# Altium project Keyboard.PrjPcb
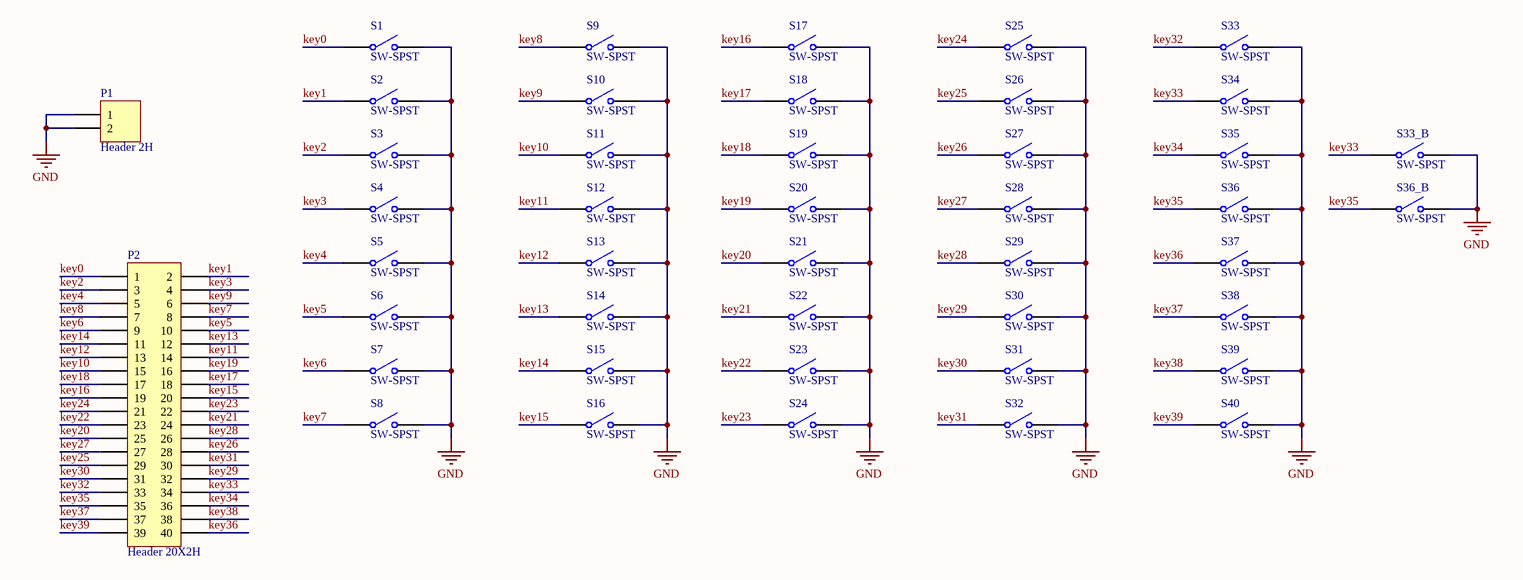
[diagram p0: keyboard.SchDoc]
1 sheet, 44 parts. Net scope: global (net labels, ports and power ports of the same name join across sheets).
Board file: Mickeyboard2.PcbDoc

## Sheet keyboard.SchDoc
size Legal

### Parts
P1  Header 2H  [HDR1X2H]
P2  Header 20X2H  [HDR2X20H]
S1  SW-SPST  [CherryMxSwitchNoLED]
S2  SW-SPST  [CherryMxSwitchNoLED]
S3  SW-SPST  [CherryMxSwitchNoLED]
S4  SW-SPST  [CherryMxSwitchNoLED]
S5  SW-SPST  [CherryMxSwitchNoLED]
S6  SW-SPST  [CherryMxSwitchNoLED]
S7  SW-SPST  [CherryMxSwitchNoLED]
S8  SW-SPST  [CherryMxSwitchNoLED]
S9  SW-SPST  [CherryMxSwitchNoLED]
S10  SW-SPST  [CherryMxSwitchNoLED]
S11  SW-SPST  [CherryMxSwitchNoLED]
S12  SW-SPST  [CherryMxSwitchNoLED]
S13  SW-SPST  [CherryMxSwitchNoLED]
S14  SW-SPST  [CherryMxSwitchNoLED]
S15  SW-SPST  [CherryMxSwitchNoLED]
S16  SW-SPST  [CherryMxSwitchNoLED]
S17  SW-SPST  [CherryMxSwitchNoLED]
S18  SW-SPST  [CherryMxSwitchNoLED]
S19  SW-SPST  [CherryMxSwitchNoLED]
S20  SW-SPST  [CherryMxSwitchNoLED]
S21  SW-SPST  [CherryMxSwitchNoLED]
S22  SW-SPST  [CherryMxSwitchNoLED]
S23  SW-SPST  [CherryMxSwitchNoLED]
S24  SW-SPST  [CherryMxSwitchNoLED]
S25  SW-SPST  [CherryMxSwitchNoLED]
S26  SW-SPST  [CherryMxSwitchNoLED]
S27  SW-SPST  [CherryMxSwitchNoLED]
S28  SW-SPST  [CherryMxSwitchNoLED]
S29  SW-SPST  [CherryMxSwitchNoLED]
S30  SW-SPST  [CherryMxSwitchNoLED]
S31  SW-SPST  [CherryMxSwitchNoLED]
S32  SW-SPST  [CherryMxSwitchNoLED]
S33  SW-SPST  [CherryMxSwitchNoLED]
S33_B  SW-SPST  [CherryMxSwitchNoLED]
S34  SW-SPST  [CherryMxSwitchNoLED]
S35  SW-SPST  [CherryMxSwitchNoLED]
S36  SW-SPST  [CherryMxSwitchNoLED]
S36_B  SW-SPST  [CherryMxSwitchNoLED]
S37  SW-SPST  [CherryMxSwitchNoLED]
S38  SW-SPST  [CherryMxSwitchNoLED]
S39  SW-SPST  [CherryMxSwitchNoLED]
S40  SW-SPST  [CherryMxSwitchNoLED]

### Nets
GND: P1.1 P1.2 S1.2(NO) S2.2(NO) S3.2(NO) S4.2(NO) S5.2(NO) S6.2(NO) S7.2(NO) S8.2(NO) S9.2(NO) S10.2(NO) S11.2(NO) S12.2(NO) S13.2(NO) S14.2(NO) S15.2(NO) S16.2(NO) S17.2(NO) S18.2(NO) S19.2(NO) S20.2(NO) S21.2(NO) S22.2(NO) S23.2(NO) S24.2(NO) S25.2(NO) S26.2(NO) S27.2(NO) S28.2(NO) S29.2(NO) S30.2(NO) S31.2(NO) S32.2(NO) S33.2(NO) S33_B.2(NO) S34.2(NO) S35.2(NO) S36.2(NO) S36_B.2(NO) S37.2(NO) S38.2(NO) S39.2(NO) S40.2(NO)
key0: P2.1 S1.1(COMMON)
key1: P2.2 S2.1(COMMON)
key2: P2.3 S3.1(COMMON)
key3: P2.4 S4.1(COMMON)
key4: P2.5 S5.1(COMMON)
key5: P2.10 S6.1(COMMON)
key6: P2.9 S7.1(COMMON)
key7: P2.8 S8.1(COMMON)
key8: P2.7 S9.1(COMMON)
key9: P2.6 S10.1(COMMON)
key10: P2.15 S11.1(COMMON)
key11: P2.14 S12.1(COMMON)
key12: P2.13 S13.1(COMMON)
key13: P2.12 S14.1(COMMON)
key14: P2.11 S15.1(COMMON)
key15: P2.20 S16.1(COMMON)
key16: P2.19 S17.1(COMMON)
key17: P2.18 S18.1(COMMON)
key18: P2.17 S19.1(COMMON)
key19: P2.16 S20.1(COMMON)
key20: P2.25 S21.1(COMMON)
key21: P2.24 S22.1(COMMON)
key22: P2.23 S23.1(COMMON)
key23: P2.22 S24.1(COMMON)
key24: P2.21 S25.1(COMMON)
key25: P2.29 S26.1(COMMON)
key26: P2.28 S27.1(COMMON)
key27: P2.27 S28.1(COMMON)
key28: P2.26 S29.1(COMMON)
key29: P2.32 S30.1(COMMON)
key30: P2.31 S31.1(COMMON)
key31: P2.30 S32.1(COMMON)
key32: P2.33 S33.1(COMMON)
key33: P2.34 S33_B.1(COMMON) S34.1(COMMON)
key34: P2.36 S35.1(COMMON)
key35: P2.35 S36.1(COMMON) S36_B.1(COMMON)
key36: P2.40 S37.1(COMMON)
key37: P2.37 S38.1(COMMON)
key38: P2.38 S39.1(COMMON)
key39: P2.39 S40.1(COMMON)

### Notes on the sheet
- Title
- Size:
- Date:
- Legal
- Number:
- Time:
- Revision:
- Sheet
- of
- File:

### Library data of the parts
P1 = Header 2H: Header, 2-Pin, Right Angle; LatestRevisionDate: 17-Jul-2002; LatestRevisionNote: Re-released for DXP Platform.; Publisher: Altium Limited
P2 = Header 20X2H: Header, 20-Pin, Dual row, Right Angle; LatestRevisionDate: 17-Jul-2002; LatestRevisionNote: Re-released for DXP Platform.; Publisher: Altium Limited
S1-S33 S33_B S34-S36 S36_B S37-S40 = SW-SPST: Single-Pole, Single-Throw Switch; Published: 24-Mar-1999; LatestRevisionDate: 17-Jul-2002; LatestRevisionNote: Re-released for DXP Platform.; PackageReference: SPST-2; Publisher: Altium Limited; PackageDescription: Switch; 2 Leads